# Altium schematic sheet Thermal_MGMT.SchDoc
size A4; ApprovedBy: Mateusz Kowalik; CheckedBy: Mateusz Kowalik; Author: Mateusz Kowalik; CompanyName: InMotion Labs sp. z o.o.; DrawnBy: Mateusz Kowalik; Engineer: Mateusz Kowalik; Organization: InMotion Labs sp. z o.o.; Address1: Rydlówka 5A; Address2: 30-363 Kraków; Address4: Poland; DocumentNumber: 15; Revision: Rev 0; SheetNumber: 15; SheetTotal: 17
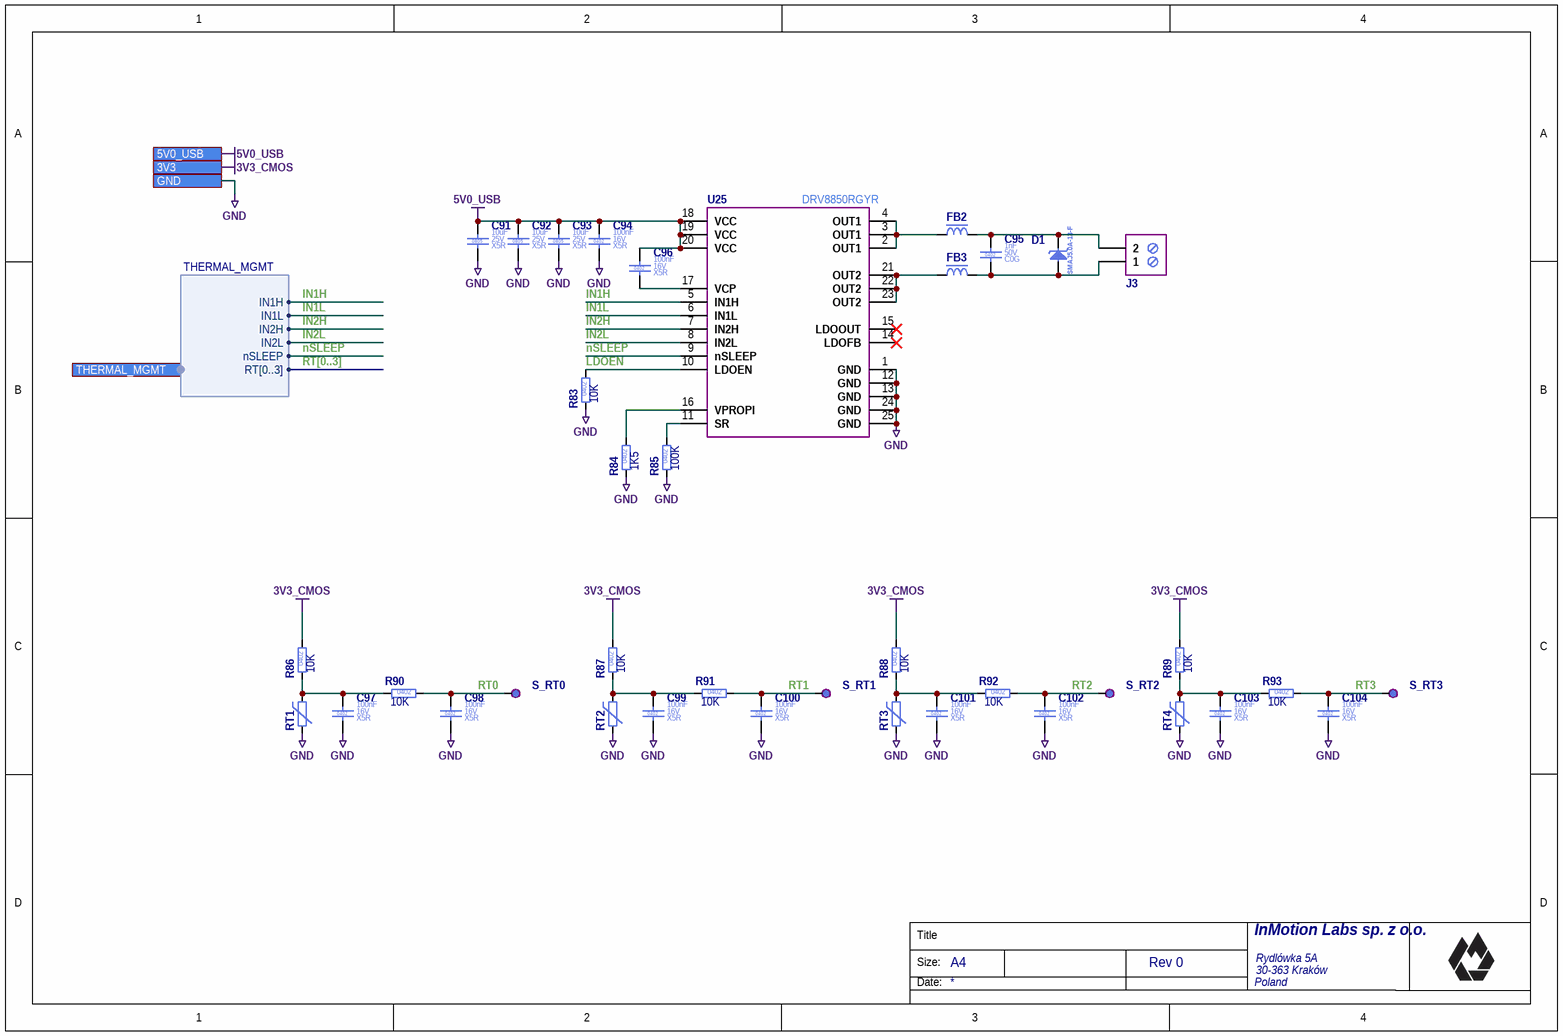
[diagram p0: Thermal_MGMT.SchDoc]

## Parts
C91  Case/Package: 0805  Voltage Rating (DC): 25V  Dielectric: X5R  Capacitance: 10uF  [C_0805_2012]  (hidden comment: C_10UF_25V_X5R_0805_10)
C92  Case/Package: 0805  Voltage Rating (DC): 25V  Dielectric: X5R  Capacitance: 10uF  [C_0805_2012]  (hidden comment: C_10UF_25V_X5R_0805_10)
C93  Case/Package: 0805  Voltage Rating (DC): 25V  Dielectric: X5R  Capacitance: 10uF  [C_0805_2012]  (hidden comment: C_10UF_25V_X5R_0805_10)
C94  Case/Package: 0402  Voltage Rating (DC): 16V  Dielectric: X5R  Capacitance: 100nF  [C_0402_1005]  (hidden comment: C_100NF_16V_X5R_0402_10)
C95  Case/Package: 0402  Voltage Rating (DC): 50V  Dielectric: C0G  Capacitance: 1nF  [C_0402_1005]  (hidden comment: C_1NF_50V_C0G_0402_5)
C96  Case/Package: 0402  Voltage Rating (DC): 16V  Dielectric: X5R  Capacitance: 100nF  [C_0402_1005]  (hidden comment: C_100NF_16V_X5R_0402_10)
C97  Case/Package: 0402  Voltage Rating (DC): 16V  Dielectric: X5R  Capacitance: 100nF  [C_0402_1005]  (hidden comment: C_100NF_16V_X5R_0402_10)
C98  Case/Package: 0402  Voltage Rating (DC): 16V  Dielectric: X5R  Capacitance: 100nF  [C_0402_1005]  (hidden comment: C_100NF_16V_X5R_0402_10)
C99  Case/Package: 0402  Voltage Rating (DC): 16V  Dielectric: X5R  Capacitance: 100nF  [C_0402_1005]  (hidden comment: C_100NF_16V_X5R_0402_10)
C100  Case/Package: 0402  Voltage Rating (DC): 16V  Dielectric: X5R  Capacitance: 100nF  [C_0402_1005]  (hidden comment: C_100NF_16V_X5R_0402_10)
C101  Case/Package: 0402  Voltage Rating (DC): 16V  Dielectric: X5R  Capacitance: 100nF  [C_0402_1005]  (hidden comment: C_100NF_16V_X5R_0402_10)
C102  Case/Package: 0402  Voltage Rating (DC): 16V  Dielectric: X5R  Capacitance: 100nF  [C_0402_1005]  (hidden comment: C_100NF_16V_X5R_0402_10)
C103  Case/Package: 0402  Voltage Rating (DC): 16V  Dielectric: X5R  Capacitance: 100nF  [C_0402_1005]  (hidden comment: C_100NF_16V_X5R_0402_10)
C104  Case/Package: 0402  Voltage Rating (DC): 16V  Dielectric: X5R  Capacitance: 100nF  [C_0402_1005]  (hidden comment: C_100NF_16V_X5R_0402_10)
D1  SMAJ5.0A-13-F  [DO-214AC]
FB2  FBMJ1608HS220NTR  [FB_0603_1608]  (value not drawn)
FB3  FBMJ1608HS220NTR  [FB_0603_1608]  (value not drawn)
J3  691101710002  [691101710002]  (value not drawn)
R83  Resistance: 10K  Case/Package: 0402  [R_0402_1005]  (hidden comment: R_10K_0402_1)
R84  Resistance: 1K5  Case/Package: 0402  [R_0402_1005]  (hidden comment: R_1K5_0402_1)
R85  Resistance: 100K  Case/Package: 0402  [R_0402_1005]  (hidden comment: R_100K_0402_1)
R86  Resistance: 10K  Case/Package: 0402  [R_0402_1005]  (hidden comment: R_10K_0402_1)
R87  Resistance: 10K  Case/Package: 0402  [R_0402_1005]  (hidden comment: R_10K_0402_1)
R88  Resistance: 10K  Case/Package: 0402  [R_0402_1005]  (hidden comment: R_10K_0402_1)
R89  Resistance: 10K  Case/Package: 0402  [R_0402_1005]  (hidden comment: R_10K_0402_1)
R90  Resistance: 10K  Case/Package: 0402  [R_0402_1005]  (hidden comment: R_10K_0402_1)
R91  Resistance: 10K  Case/Package: 0402  [R_0402_1005]  (hidden comment: R_10K_0402_1)
R92  Resistance: 10K  Case/Package: 0402  [R_0402_1005]  (hidden comment: R_10K_0402_1)
R93  Resistance: 10K  Case/Package: 0402  [R_0402_1005]  (hidden comment: R_10K_0402_1)
RT1  NCP15XH103J03RC  [R_0402_1005]  (value not drawn)
RT2  NCP15XH103J03RC  [R_0402_1005]  (value not drawn)
RT3  NCP15XH103J03RC  [R_0402_1005]  (value not drawn)
RT4  NCP15XH103J03RC  [R_0402_1005]  (value not drawn)
S_RT0  TP_PAD_1.3MM  [TP_PAD_1.3MM]  (value not drawn)  (no BOM)
S_RT1  TP_PAD_1.3MM  [TP_PAD_1.3MM]  (value not drawn)  (no BOM)
S_RT2  TP_PAD_1.3MM  [TP_PAD_1.3MM]  (value not drawn)  (no BOM)
S_RT3  TP_PAD_1.3MM  [TP_PAD_1.3MM]  (value not drawn)  (no BOM)
U25  DRV8850RGYR  [PQFN50P350X550X100_HS-25N]

## Ports
3V3, 5V0_USB, GND, THERMAL_MGMT (harness THERMAL_MGMT)

## Harnesses
THERMAL_MGMT: RT[0..3], nSLEEP, IN2L, IN2H, IN1L, IN1H

## Nets
3V3_CMOS: R86.2 R87.2 R88.2 R89.2 ; port 3V3
5V0_USB: C91.1 C92.1 C93.1 C94.1 C96.1 U25.18(VCC) U25.19(VCC) U25.20(VCC) ; port 5V0_USB
GND: C91.2 C92.2 C93.2 C94.2 C97.2 C98.2 C99.2 C100.2 C101.2 C102.2 C103.2 C104.2 R83.1 R84.1 R85.1 RT1.1 RT2.1 RT3.1 RT4.1 U25.1(GND) U25.12(GND) U25.13(GND) U25.24(GND) U25.25(GND) ; port GND
IN1H: U25.5(IN1H) ; port THERMAL_MGMT.IN1H
IN1L: U25.6(IN1L) ; port THERMAL_MGMT.IN1L
IN2H: U25.7(IN2H) ; port THERMAL_MGMT.IN2H
IN2L: U25.8(IN2L) ; port THERMAL_MGMT.IN2L
LDOEN: R83.2 U25.10(LDOEN)
nSLEEP: U25.9(nSLEEP) ; port THERMAL_MGMT.nSLEEP
RT0: C98.1 R90.2 S_RT0.1(TP)
RT1: C100.1 R91.2 S_RT1.1(TP)
RT2: C102.1 R92.2 S_RT2.1(TP)
RT3: C104.1 R93.2 S_RT3.1(TP)
NetC95_1: C95.1 D1.1(C) FB2.2 J3.2
NetC95_2: C95.2 D1.2(A) FB3.2 J3.1
NetC96_2: C96.2 U25.17(VCP)
NetC97_1: C97.1 R86.1 R90.1 RT1.2
NetC99_1: C99.1 R87.1 R91.1 RT2.2
NetC101_1: C101.1 R88.1 R92.1 RT3.2
NetC103_1: C103.1 R89.1 R93.1 RT4.2
NetFB2_1: FB2.1 U25.2(OUT1) U25.3(OUT1) U25.4(OUT1)
NetFB3_1: FB3.1 U25.21(OUT2) U25.22(OUT2) U25.23(OUT2)
NetR84_2: R84.2 U25.16(VPROPI)
NetR85_2: R85.2 U25.11(SR)

Not connected (* = marked no-connect by the designer): U25 14(LDOFB)* 15(LDOOUT)*

## Buses and harness runs
bus RT[0..3]

## Notes on the sheet
- Title
- Size:
- Date:
- A4

## Library data of the parts
C91-C93 = C_10UF_25V_X5R_0805_10: Ceramic Capacitor; Manufacturer Part Number: CL21A106KAYNNNE; Manufacturer: Samsung Electro-Mechanics; Value: 10uF; Tolerance: 10%; Part Number: C_10UF_25V_X5R_0805_10; Mount: Surface Mount; Height: 1.35mm; HelpURL: https://pl.mouser.com/datasheet/2/585/MLCC-1837944.pdf; RoHS: Compliant; Max Operating Temperature: 85°C; Status: MK; Supplier 1: Mouser; Supplier Part Number 1: 187-CL21A106KAYNNNE; Supplier 2: LCSC; Supplier Part Number 2: C15850; Manufacturer 2: Samsung Electro-Mechanics; Manufacturer Part Number 2: CL21A106KAYNNNE
C94 C96-C104 = C_100NF_16V_X5R_0402_10: Ceramic Capacitor; Manufacturer Part Number: EMK105BJ104KV-F; Manufacturer: Taiyo Yuden; Value: 100nF; Tolerance: 10%; Part Number: C_100NF_16V_X5R_0402_10; Mount: Surface Mount; Height: 500um; HelpURL: http://datasheet.octopart.com/EMK105BJ104KV-F-Taiyo-Yuden-datasheet-8857305.pdf; RoHS: Compliant; Max Operating Temperature: 125°C; Status: MK; Supplier 1: Mouser; Supplier Part Number 1: 963-EMK105BJ104KV-F; Manufacturer 2: Samsung Electro-Mechanics; Manufacturer Part Number 2: CL05B104KO5NNNC; Supplier 2: LCSC; Supplier Part Number 2: C1525
C95 = C_1NF_50V_C0G_0402_5: Ceramic Capacitor; Manufacturer Part Number: UMK105CG102JV-F; Manufacturer: Taiyo Yuden; Value: 1nF; Tolerance: 5%; Part Number: C_1NF_50V_C0G_0402_5; Mount: Surface Mount; Height: 500um; HelpURL: https://pl.mouser.com/datasheet/2/396/mlcc02_e-1307760.pdf; RoHS: Compliant; Max Operating Temperature: 125°C; Status: AK; Supplier 1: Mouser; Supplier Part Number 1: 963-JMK212ABJ106KG-T; Manufacturer 2: Guangdong Fenghua Advanced Tech; Manufacturer Part Number 2: 0402B102K500NT; Supplier 2: LCSC; Supplier Part Number 2: C1523
D1 = SMAJ5.0A-13-F: ESD Suppressors / TVS Diodes; Manufacturer: Diodes Inc; Max Power Dissipation: 400W; Direction: Unidirectional; Max Breakdown Voltage: 7.25V; Working Voltage: 5V; Min Breakdown Voltage: 6.4V; Box: 4; Part Number: SMAJ5.0A-13-F; Case/Package: DO-214AC; Manufacturer Part Number: SMAJ5.0A-13-F; Mount: Surface Mount; HelpURL: http://datasheet.octopart.com/SMAJ5.0A-13-F-Diodes-Inc.-datasheet-8324759.pdf; Max Operating Temperature: 150°C; RoHS: Compliant; Height: 2.42mm; Supplier 1: Mouser; Supplier Part Number 1: 621-SMAJ5.0A-13-F; Stock: 17
FB2 FB3 = FBMJ1608HS220NTR: Ferrite Bead; Manufacturer: Taiyo Yuden; Max Current Rating: 7.5A; Frequency: 100MHz; Impedance: 22; Tolerance: 30; DC Resistance (DCR): 4m; Part Number: FBMJ1608HS220NTR; Case/Package: 0603; Manufacturer Part Number: FBMJ1608HS220NTR; Height: 1mm; Mount: Surface Mount; Max Operating Temperature: 125; HelpURL: https://datasheet.octopart.com/FBMJ1608HS220NTR-Taiyo-Yuden-datasheet-17272614.pdf; RoHS: Compliant; Status: MK; Supplier 1: Mouser; Supplier Part Number 1: 963-FBMJ1608HS220NTR
J3 = 691101710002: PCB Terminal Block 1x2; Manufacturer: Wurth Elektronik; Pitch: 5mm; Gender: Receptacle; Box: A13; Part Number: 691101710002; Series: WR-TBL 101; Number of Rows: 1; Mount: Through Hole; Orientation: Horizontal; HelpURL: https://www.we-online.com/catalog/datasheet/691101710002.pdf; Max Operating Temperature: 105; Number of Pins: 2; RoHS: Compliant; Manufacturer Part Number: 691101710002; Status: MK; Supplier 1: Wurth Elektronik; Supplier Part Number 1: 691101710002; Stock: 50
R83 R86-R93 = R_10K_0402_1: Thick Film Resistor; Manufacturer: Yageo; Manufacturer Part Number: RC0402FR-7W10KL; Value: 10K; Tolerance: 1%; Voltage Rating (DC): 50V; Power Rating: 63mW; Stats: MK; Part Number: R_10K_0402_1; Mount: Surface Mount; Height: 350um; HelpURL: https://pl.mouser.com/datasheet/2/447/PYu-RC_Group_51_RoHS_L_10-1664068.pdf; RoHS: Compliant; Max Operating Temperature: 155°C; Supplier 1: Mouser; Supplier Part Number 1: 603-RC0402FR-7W10KL; Manufacturer 2: Uniroyal Elec; Manufacturer Part Number 2: 0402WGF1002TCE; Supplier 2: LCSC; Supplier Part Number 2: C25744
R84 = R_1K5_0402_1: Thick Film Resistor; Manufacturer: Yageo; Manufacturer Part Number: RC0402FR-071K5L; Value: 1K5; Tolerance: 1%; Voltage Rating (DC): 50V; Power Rating: 63mW; Part Number: R_1K5_0402_1; Mount: Surface Mount; Height: 350um; HelpURL: https://pl.mouser.com/datasheet/2/447/PYu-RC_Group_51_RoHS_L_10-1527934.pdf; RoHS: Compliant; Max Operating Temperature: 155°C; Supplier 1: Mouser; Supplier Part Number 1: 603-RC0402FR-071K5L; Manufacturer 2: Uniroyal Elec; Manufacturer Part Number 2: 0402WGF1501TCE; Supplier 2: LCSC; Supplier Part Number 2: C25867
R85 = R_100K_0402_1: Thick Film Resistor; Manufacturer: Yageo; Manufacturer Part Number: RC0402FR-07100KL; Value: 100K; Tolerance: 1%; Voltage Rating (DC): 50V; Power Rating: 63mW; Stats: MK; Part Number: R_100K_0402_1; Mount: Surface Mount; Height: 350um; HelpURL: http://datasheet.octopart.com/RC0402FR-07100KL-Yageo-datasheet-127823281.pdf; RoHS: Compliant; Max Operating Temperature: 155°C; Supplier 1: Mouser; Supplier Part Number 1: 603-RC0402FR-07100KL; Manufacturer 2: Uniroyal Elec; Manufacturer Part Number 2: 0402WGF1003TCE; Supplier 2: LCSC; Supplier Part Number 2: C25741
RT1-RT4 = NCP15XH103J03RC: NTC Thermistor; Manufacturer: Murata; Output Current: 310uA; Output Type: Analog Voltage; Accuracy: 0.7%; Sensor Type: Temperature; Box: 257; Part Number: NCP15XH103J03RC; Manufacturer Part Number: NCP15XH103J03RC; Case/Package: 0402; Mount: Surface Mount; Height: 0.5mm; HelpURL: http://datasheet.octopart.com/NCP15XH103J03RC-Murata-datasheet-11547476.pdf; Max Operating Temperature: 125°C; RoHS: Compliant; Status: MK; Supplier 1: Mouser; Supplier Part Number 1: 81-NCP15XH103J03RC; Stock: 38
S_RT0-S_RT3 = TP_PAD_1.3MM: Testpoint SMD 1.3mm; Part Number: TP_PAD_1.3MM; Case/Package: SMD; Length: 0mm
U25 = DRV8850RGYR: Low Voltage H-Bridge IC With LDO Voltage Regulator; Manufacturer: Texas Instruments; Output Current: 5A; Max Output Current: 9.5A; Number of Outputs: 1; Interface: Paralell; Switching Frequency: 50KHz; Max Supply Voltage: 5.5V; Min Supply Voltage: 2V; Manufacturer Part Number: DRV8850RGYR; Part Number: DRV8850RGYR; Mount: Surface Mount; HelpURL: https://www.ti.com/lit/ds/symlink/drv8850.pdf; Marking: DRV8850; Max Operating Temperature: 85°C; Height: 1mm; RoHS: Compliant; Supplier 1: Mouser; Supplier Part Number 1: 595-DRV8850RGYR